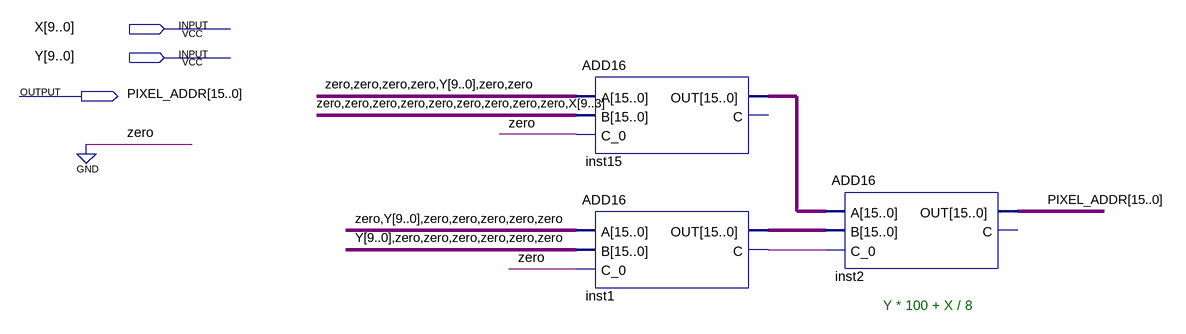
[diagram p0: schematic sheet]
// Quartus schematic PixelAddrCalculator.bdf as structural Verilog: 3 symbols, 3 pins
module PixelAddrCalculator (
  input  [9:0] X,
  input  [9:0] Y,
  output [15:0] PIXEL_ADDR
);

  wire inst1_c;
  wire [15:0] inst1_out, inst15_out;

  ADD16 inst15 (.A({4'b0000, Y, 2'b00}), .B({{9{1'b0}}, X[9:3]}), .C_0(1'b0), .OUT(inst15_out));  // open: C
  ADD16 inst1 (.A({1'b0, Y, {5{1'b0}}}), .B({Y, {6{1'b0}}}), .C_0(1'b0), .OUT(inst1_out), .C(inst1_c));
  ADD16 inst2 (.A(inst15_out), .B(inst1_out), .C_0(inst1_c), .OUT(PIXEL_ADDR));  // open: C

  // Notes on the sheet:
  //   Y * 100 + X / 8
endmodule
